# Altium schematic sheet robotShield_Power.SchDoc
size A4; SheetNumber: 2; SheetTotal: 6
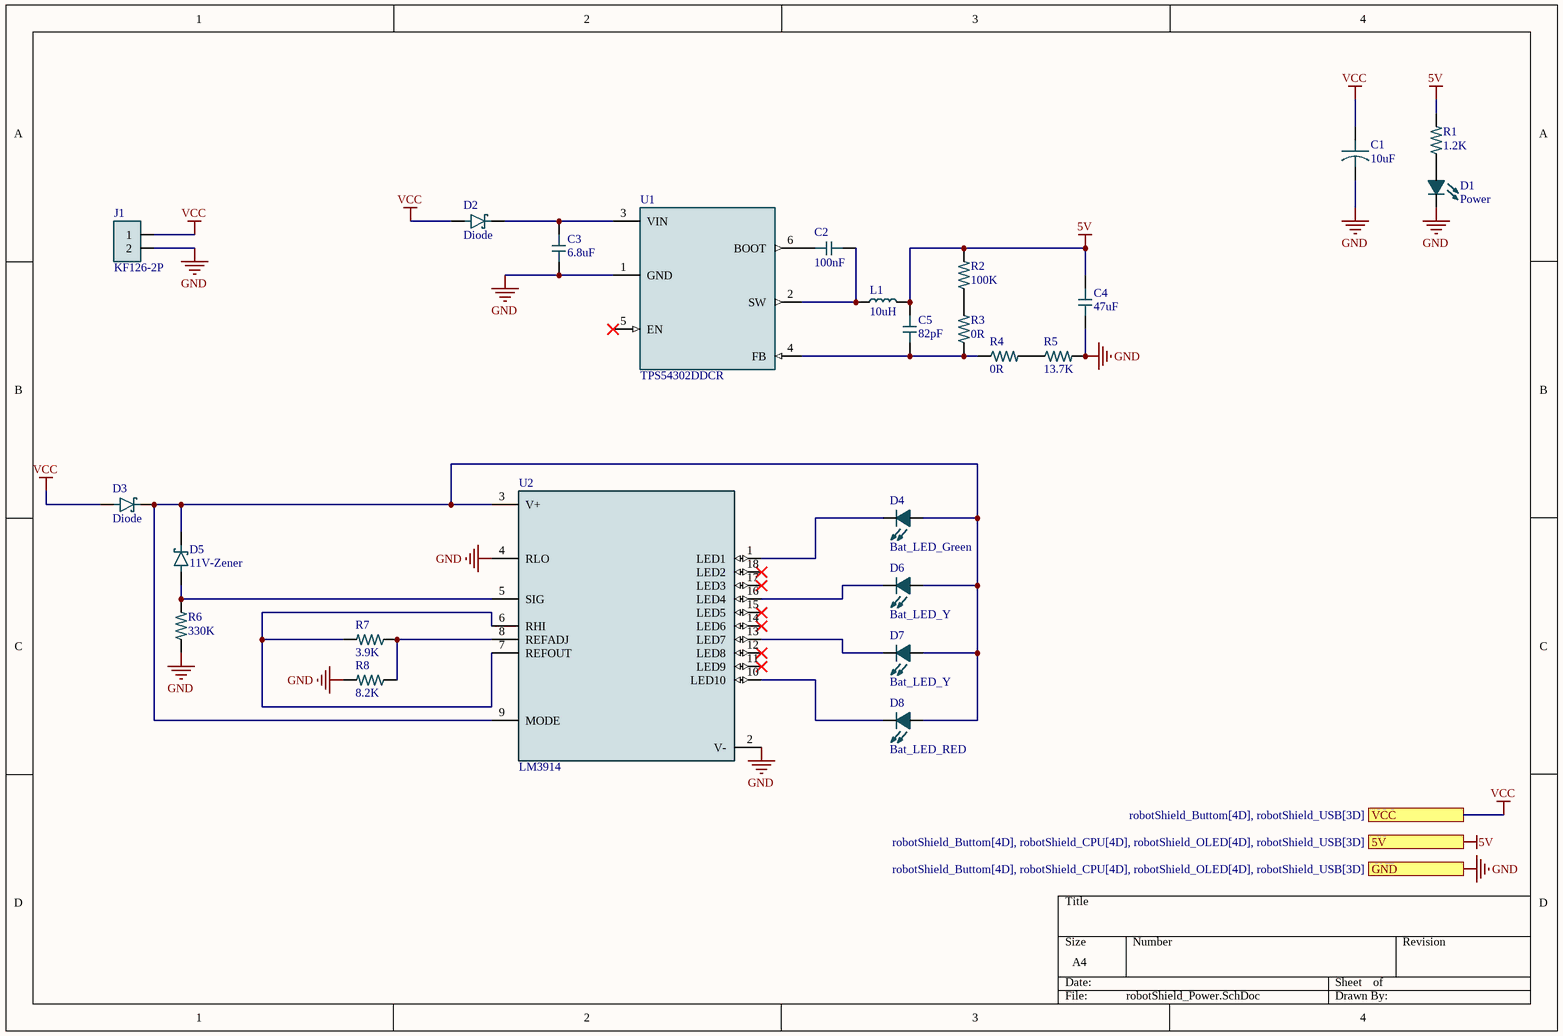
[diagram p0: robotShield_Power.SchDoc]

## Parts
C1  10uF  [TAJA]
C2  100nF  [CAP0603]
C3  6.8uF  [CAP0603]
C4  47uF  [CAP0603]
C5  82pF  [CAP0603]
D1  Power  [LED0603]
D2  Diode  [SS36]
D3  Diode  [SS36]
D4  Bat_LED_Green  [LED0603]
D5  11V-Zener  [MBR0520LT3G]
D6  Bat_LED_Y  [LED0603]
D7  Bat_LED_Y  [LED0603]
D8  Bat_LED_RED  [LED0603]
J1  KF126-2P  [KF126-2P]
L1  10uH  [Inductor1515]
R1  1.2K  [RES0603]
R2  100K  [RES0603]
R3  0R  [RES0603]
R4  0R  [RES0603]
R5  13.7K  [RES0603]
R6  330K  [RES0603]
R7  3.9K  [RES0603]
R8  8.2K  [RES0603]
U1  TPS54302DDCR  [TPS54302DDCR]
U2  LM3914  [LM3914N-1]

## Ports
5V (see robotShield_Buttom[4D], robotShield_CPU[4D], robotShield_OLED[4D], robotShield_USB[3D]), GND (see robotShield_Buttom[4D], robotShield_CPU[4D], robotShield_OLED[4D], robotShield_USB[3D]), VCC (see robotShield_Buttom[4D], robotShield_USB[3D])

## Nets
5V: C4.1 C5.1 L1.2 R1.2 R2.2 ; port 5V
GND: C1.NEG C3.2 C4.2 D1.C J1.2 R5.2 R6.1 R8.2 U1.1(GND) U2.2(V-) U2.4(RLO) ; port GND
VCC: C1.POS D2.A D3.A J1.1 ; port VCC
NetC2_1: C2.1 U1.6(BOOT)
NetC2_2: C2.2 L1.1 U1.2(SW)
NetC3_1: C3.1 D2.C(K) U1.3(VIN)
NetC5_2: C5.2 R3.1 R4.1 U1.4(FB)
NetD1_A: D1.A R1.1
NetD3_C: D3.C(K) D4.A D5.C(K) D6.A D7.A D8.A U2.3(V+) U2.9(MODE)
NetD4_C: D4.C U2.1(LED1)
NetD5_A: D5.A R6.2 U2.5(SIG)
NetD6_C: D6.C U2.16(LED4)
NetD7_C: D7.C U2.13(LED7)
NetD8_C: D8.C U2.10(LED10)
NetR2_1: R2.1 R3.2
NetR4_2: R4.2 R5.1
NetR7_1: R7.1 R8.1 U2.8(REFADJ)
NetR7_2: R7.2 U2.6(RHI) U2.7(REFOUT)

Not connected (* = marked no-connect by the designer): U1 5(EN)*; U2 11(LED9)* 12(LED8)* 14(LED6)* 15(LED5)* 17(LED3)* 18(LED2)*

## Library data of the parts
C1 = CapacitorP: Cap Tant Solid SMD 3216-18 3 Ohm 125Â°C T/R; MF: AVX; MP: TAJA106K010YNJ; SnapEDA_Link: https://www.snapeda.com/parts/TAJA106K010YNJ/AVX/view-part/1683849/?ref=snap; Price: None; Value: *; Availability: Unavailable; Package: 1206 AVX
C2-C5 = Capacitor: CAP SMD; MF: AVX; MP: LD031A101GAB2A; SnapEDA_Link: https://www.snapeda.com/parts/LD031A101GAB2A/AVX/view-part/1973966/?ref=snap; Price: None; Availability: Unavailable; Package: 0603 AVX; Value: *
D1 D4 D6-D8 = LED: MP: LTW-C191TLA; Package: None; Availability: Unavailable; Value: LED; Price: None
D2 D3 D5 = Schottky Diode: MF: Diotec Semiconductor; MP: S1M; Value: *; Price: None; Package: DO-214AC-2 Diotec; Availability: In Stock; SnapEDA_Link: https://www.snapeda.com/parts/S1M/Diotec/view-part/?ref=snap; Purchase-URL: https://pricing.snapeda.com/search/part/S1M/?ref=eda; Check_prices: https://www.snapeda.com/parts/S1M/Diotec/view-part/?ref=eda
J1 = KF126-2P: Terminal Block Connector Wire Receptacle 2 5 mm 30-16 AWG Green 13.5 A 300 V | TE Connectivity 282836-2; SnapEDA_Link: https://www.snapeda.com/parts/282836-2/TE+Connectivity+AMP+Connectors/view-part/?ref=snap; Package: None; Value: KF126-2P; MF: TE Connectivity; MP: 282836-2; Check_prices: https://www.snapeda.com/parts/282836-2/TE+Connectivity+AMP+Connectors/view-part/?ref=eda
L1 = Inductor: Inductor with Inductance 6.8uH Tol.+/-20%; MP: LQM18DN6R8M70B; Package: None; Price: None; Value: *; Availability: Unavailable
R1-R8 = Resistor: RES 0.27 OHM 1% 1/10W; Power_Rating: .1 W; MP: 3-1879460-5; Resistance: 27; MF: TE Connectivity; SnapEDA_Link: https://www.snapeda.com/parts/3-1879460-5/TE+Connectivity/view-part/?ref=snap; Package: 0603; Check_prices: https://www.snapeda.com/parts/3-1879460-5/TE+Connectivity/view-part/?ref=eda; EU_RoHS_Compliance: Compliant with Exemptions; Price: None; Tolerance: 1%; Availability: In Stock; Value: *
U1 = TPS54302DDCR: 4.5-V to 28-V Input, 3-A Output, EMI Friendly Synchronous Step-Down Converter; MF: Texas Instruments; Package: SOT-23-THN-6 Texas Instruments; Price: None; Check_prices: https://www.snapeda.com/parts/TPS54302DDCR/Texas+Instruments/view-part/?ref=eda; Value: *; SnapEDA_Link: https://www.snapeda.com/parts/TPS54302DDCR/Texas+Instruments/view-part/?ref=snap; MP: TPS54302DDCR; Availability: In Stock; Purchase-URL: https://pricing.snapeda.com/search?q=TPS54302DDCR&ref=eda
U2 = LM3914N-1: LED, LCD, Vacuum Fluorescent (VF) Driver 18-PDIP; MF: Texas Instruments; MP: LM3914N-1/NOPB; SnapEDA_Link: https://www.snapeda.com/parts/LM3914N-1/NOPB/Texas+Instruments/view-part/?ref=snap; Package: PDIP-18 Texas Instruments; Value: *; Check_prices: https://www.snapeda.com/parts/LM3914N-1/NOPB/Texas+Instruments/view-part/?ref=eda